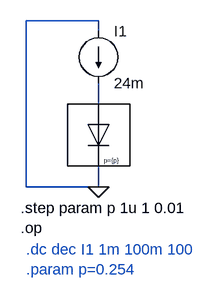
[diagram p0: schematic sim_rubber_diode_vbe.asc]
sim_rubber_diode_vbe.asc, the LTspice schematic file:
Version 4
SHEET 1 880 680
WIRE 240 48 128 48
WIRE 240 64 240 48
WIRE 240 176 240 144
WIRE 128 304 128 48
WIRE 240 304 240 272
WIRE 240 304 128 304
FLAG 240 304 0
SYMBOL current 240 64 R0
WINDOW 123 0 0 Left 0
WINDOW 39 0 0 Left 0
SYMATTR InstName I1
SYMATTR Value 24m
SYMBOL rubber_diode 240 224 R0
WINDOW 0 0 0 Invisible 0
WINDOW 39 8 39 Left 0
SYMATTR InstName X1
SYMATTR SpiceLine p={p}
TEXT 120 336 Left 2 !.step param p 1u 1 0.01\n.op
TEXT 128 400 Left 2 ;.dc dec I1 1m 100m 100\n.param p=0.254

The netlist it stands for:
* sim_rubber_diode_vbe.asc
I1 0 N001 24m
XX1 N001 0 rubber_diode params: p={p}  ; pins A K
.step param p 1u 1 0.01
.op
* .dc dec I1 1m 100m 100
* .param p=0.254
.backanno
.end